# EAGLE design wx_station (EAGLE 4.16)
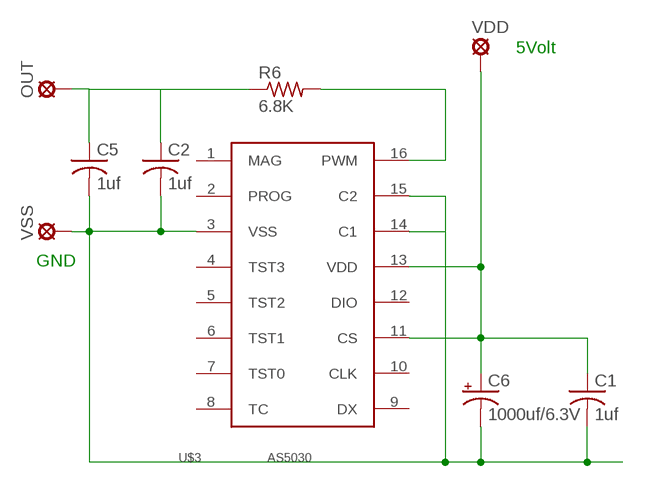
[diagram p0: schematic, sheet 1]

## Parts
C1  1uf  C-USC0805K  [C0805K]
C2  1uf  C-USC0805K  [C0805K]
C5  1uf  C-USC0805K  [C0805K]
C6  1000uf/6.3V  CPOL-USE3.5-8  [E3,5-8]
OUT  LSP10  [LSP10]
R6  6.8K  R-US_M0805  [M0805]
U$3  AS5030  [TSSOP16]
VDD  LSP10  [LSP10]
VSS  LSP10  [LSP10]

## Nets
N$1: C1.1 C6.+ U$3.11(CS) U$3.13(VDD) VDD.MP
N$2: C1.2 C2.2 C5.2 C6.- U$3.3(VSS) U$3.14(C1) U$3.15(C2) VSS.MP
N$22: C2.1 C5.1 OUT.MP R6.1
N$23: R6.2 U$3.16(PWM)
Unconnected: U$3.1(MAG) U$3.2(PROG) U$3.4(TST3) U$3.5(TST2) U$3.6(TST1) U$3.7(TST0) U$3.8(TC) U$3.9(DX) U$3.10(CLK) U$3.12(DIO)

## Notes on the sheet
- 5Volt
- GND

## Library data of the parts
C1 C2 C5 = rcl:C-US: CAPACITOR, American symbol
C6 = rcl:CPOL-US: POLARIZED CAPACITOR, American symbol
OUT VDD VSS = solpad:LSP10: SOLDER PAD drill 1.0 mm, distributor Buerklin, 12H555
R6 = rcl:R-US_: RESISTOR, American symbol
U$3 = Stofer:AS5030

## Board
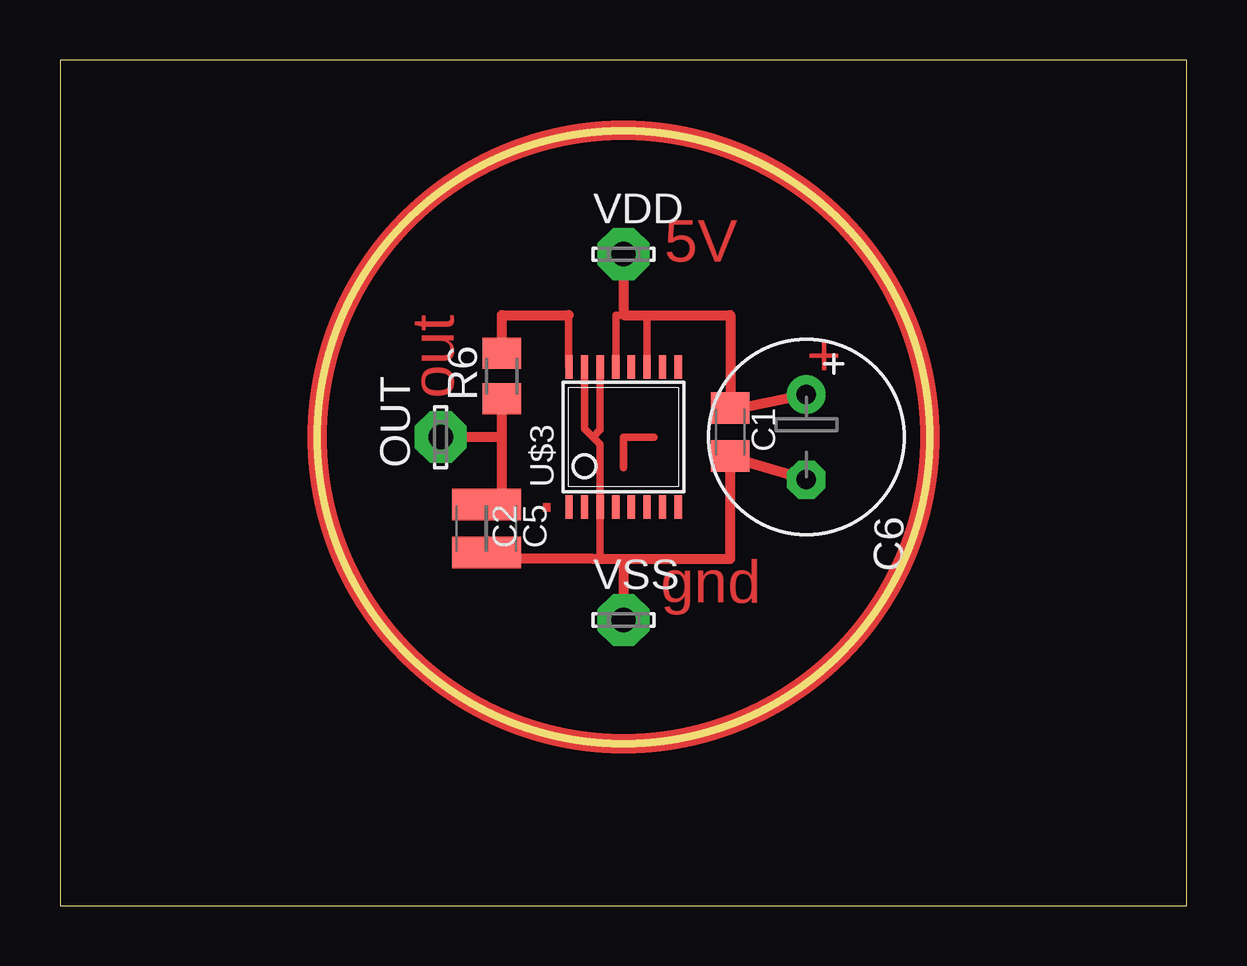
[diagram p1: board, top side]

Size 46.97 x 35.23 mm. Coordinates in mm from the lower left corner, seen from the top.
Outline: 0,0 46.97,0 46.97,35.23 0,35.23 0,0
Outline: circle at 23.49,19.52 radius 12.76
Copper layers (1*2+15*16): Top 0.035mm / dielectric 0.2mm / Route2 0.035mm / dielectric 0.15mm / Route15 0.035mm / dielectric 0.2mm / Bottom 0.035mm
Design rules "default": minimum track width 10mil, minimum drill 24mil, track to track 8mil, track to pad 8mil, pad to pad 8mil, via to via 8mil, smd to smd 8mil, copper to edge 40mil, drill to drill 8mil, minimum pad ring 15mil, minimum via ring 8mil, stop-mask expansion 4mil, vias tented up to drill 0mil, thermal gap 10mil

### Footprints (pad centres in the part's own frame; a part is rotated, then mirrored left to right if it is on the bottom)
C0805K = smd 1.3 x 1.6: 1 -1,0; 2 1,0
E3,5-8 = drill 0.813 pad 1.6 round: + -1.778,0 | drill 0.813 pad 1.6 octagon: - 1.778,0
LSP10 = drill 1.016 pad 2.159 octagon: MP 0,0
M0805 = smd 1.3 x 1.6: 1 -0.95,0; 2 0.95,0
TSSOP16 = smd 0.305 x 0.991: 1 -2.275,-2.918; 2 -1.625,-2.918; 3 -0.975,-2.918; 4 -0.325,-2.918; 5 0.325,-2.918; 6 0.975,-2.918; 7 1.625,-2.918; 8 2.275,-2.918; 9 2.275,2.918; 10 1.625,2.918; 11 0.975,2.918; 12 0.325,2.918; 13 -0.325,2.918; 14 -0.975,2.918; 15 -1.625,2.918; 16 -2.275,2.918

### Placement (x,y rotation side)
C1  27.93,19.73 270 top
C2  17.14,15.71 270 top
C5  18.41,15.71 270 top
C6  31.11,19.52 270 top
OUT  15.87,19.52 90 top
R6  18.41,22.06 90 top
U$3  23.49,19.52 0 top
VDD  23.49,27.14 0 top
VSS  23.49,11.9 0 top

### Tracks (layer width: path | path; a pad name or v marks a point on that pad's centre or on a via)
N$1
  Top 0.254: U$3.13 | 23.49,24.6 VDD.MP | C1.1 27.84,20.82
  Top 0.305: U$3.11 24.46,24.6 23.49,24.6 23.17,24.6 U$3.13
  Top 0.406: VDD.MP 23.49,24.83 | C6.+ 28.57,20.79 C1.1 27.94,24.6 23.49,24.6
N$2
  Top 0.254: 18.68,14.44 C5.2 | C1.2 27.99,18.67
  Top 0.305: U$3.15 21.86,19.88 22.22,19.52 | U$3.14 22.51,19.82 22.22,19.52 | 22.22,19.52 22.51,19.22 U$3.3 22.51,14.44 22.22,14.44
  Top 0.406: 23.49,14.44 VSS.MP | 23.49,14.44 22.22,14.44 18.68,14.44 17.14,14.44 C2.2 | C6.- 31.06,17.78 27.99,18.67 | C1.2 27.94,14.44 23.49,14.44
N$3
  Top 0.305: 24.76,19.52 23.49,19.52 23.49,18.25
N$22
  Top 0.406: R6.1 18.41,19.52 | 18.41,19.52 C5.1 18.5,16.71 C2.1 | 18.41,19.52 OUT.MP
N$23
  Top 0.254: 21.2,22.45 U$3.16 | 18.66,23.33 18.66,23.26 R6.2
  Top 0.305: 21.2,24.6 21.2,22.45
  Top 0.406: 21.2,24.6 18.41,24.6 R6.2
(copper drawn outside any net)
  shapes: Top circle x1

### Text on the board
Top: 5V | + | out | . | gnd